# Altium project PCB_Project_work.PrjPcb
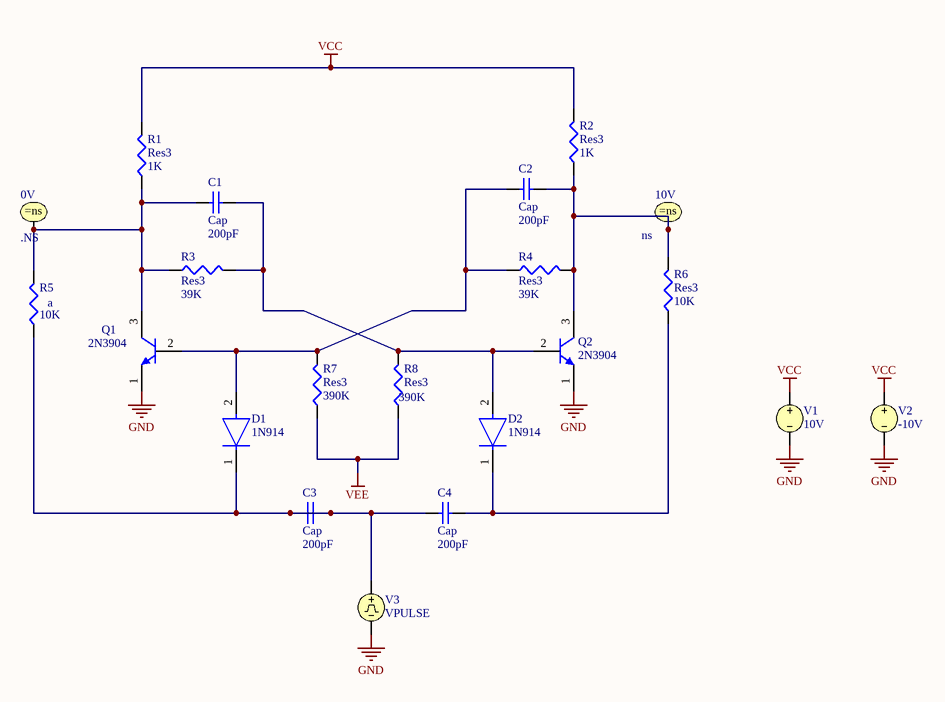
[diagram p0: classwork 2.0.SchDoc]
1 sheet, 21 parts. Net scope: global (net labels, ports and power ports of the same name join across sheets).
Board file: PCB4.PcbDoc

## Sheet classwork 2.0.SchDoc
size A4

### Parts
0V  .NS
10V  ns
C1  Cap  value 200pF  [RAD-0.3]
C2  Cap  value 200pF  [RAD-0.3]
C3  Cap  value 200pF  [RAD-0.3]
C4  Cap  value 200pF  [RAD-0.3]
D1  1N914  [FP-502-01-MFG]
D2  1N914  [FP-502-01-MFG]
Q1  2N3904  [ONSC-TO-92-3-29-11]
Q2  2N3904  [ONSC-TO-92-3-29-11]
R1  Res3  value 1K  [J1-0603]
R2  Res3  value 1K  [J1-0603]
R3  Res3  value 39K  [J1-0603]
R4  Res3  value 39K  [J1-0603]
R5  a  value 10K  [J1-0603]
R6  Res3  value 10K  [J1-0603]
R7  Res3  value 390K  [J1-0603]
R8  Res3  value 390K  [J1-0603]
V1  10V
V2  -10V
V3  VPULSE

### Nets
GND: Q1.1(E) Q2.1(E) V1.2 V2.2 V3.2
VCC: R1.2 R2.2 V1.1 V2.1
VEE: R7.1 R8.1
Net0V_1: 0V.1 C1.1 Q1.3(C) R1.1 R3.1 R5.2
Net10V_1: 10V.1 C2.2 Q2.3(C) R2.1 R4.2 R6.2
NetC1_2: C1.2 D2.2(A) Q2.2(B) R3.2 R8.2
NetC2_1: C2.1 D1.2(A) Q1.2(B) R4.1 R7.2
NetC3_1: C3.1 C3.2 C4.1 D1.1(C) R5.1 V3.1
NetC4_2: C4.2 D2.1(C) R6.1

### Library data of the parts
0V 10V = .NS: Node Set; Published: 8-Jun-2000; LatestRevisionDate: 17-Jul-2002; LatestRevisionNote: Re-released for DXP Platform.; PackageReference: Not Applicable; Publisher: Altium Limited
C1-C4 = Cap: Capacitor; Published: 8-Jun-2000; LatestRevisionDate: 17-Jul-2002; LatestRevisionNote: Re-released for DXP Platform.; PackageReference: RAD-0.3; Publisher: Altium Limited; PackageDescription: Radial Cap, Thru-Hole; 2 Leads; 0.3 in Pin Spacing
D1 D2 = CMP-07163-000008-1: DIODE GEN PURP 75V 200MA SOD523F; Manufacturer Part Number: 1N914BWT; Manufacturer: ON Semiconductor; Forward Current: 300mA; Capacitance: 4pF; Max Junction Temp: +150°C; Reverse Voltage: 100V; Value: 4pF; Peak Reverse Current: 5uA; ComponentLink2Description: Datasheet; Package: 502-01; Digikey Description: DIODE GEN PURP 75V 200MA SOD523F; Temperature Range High: +150°C; Temperature: -55°C to +150°C; Footprint Url: https://www.onsemi.com/pub/Collateral/502-01.PDF; Device Class L2: Diodes; Lead Free: Yes; Automotive: No; Category: Diode; Octopart: https://octopart.com/1n914bwt-on+semiconductor-84323166; Device Class L1: Discrete Semiconductors; Ipc Land Pattern Name: SODFL16080X60; Device Class L3: Rectifier Diodes; Height: 0.7mm; Max Repetitive Reverse Voltage: 75V; Mouser Description: Diodes - General Purpose, Power, Switching SINGLE JUNC. 100V 4.0NS COMP; Temperature Range Low: -55°C; ComponentLink2URL: https://www.onsemi.com/pub/Collateral/1N914BWT-D.pdf; RoHS: TRUE
Q1 Q2 = CMP-2000-05562-1: General Purpose Transistor, NPN Silicon, 200 mA, 60 V, -55 to 150 degC, 3-Pin TO-92, RoHS, Bulk; Manufacturer: ONSemiconductor; Emitter- Base Voltage VEBO: 6V; Maximum Power Dissipation: 625mW; Maximum DC Collector Current: 0.2A; Collector- Emitter Voltage VCEO Max: 40V; Collector- Base Voltage VCBO: 60V; DC Collector/Base Gain hfe Min: 60; Configuration: Single; Collector-Emitter Saturation Voltage: 0.3V; Gain Bandwidth Product fT: 270MHz; Mounting Style: ThroughHole; Package / Case: TO-92-3(TO-226); Mounting Technology: ThroughHole; Minimum Operating Temperature: -65C; Datasheet Version: Rev. 8, 08/2012; Product Category: BipolarTransistors-BJT; Factory Pack Quantity: 5000; Transistor Polarity: NPN; Package Description: 3-Pin Transistor Outline, Body 4.825 x 3.685 mm, Pitch 1.27 mm; RoHS: Details; Datasheet URL: https://datasheet.ciiva.com/4725/2n3903-d-285841-4725808.pdf; Packaging: Bulk; Maximum Operating Temperature: +150C; Package Reference: TO-92-3-29-11; Brand: ONSemiconductor; Manufacturer URL: http://www.onsemi.com/
R1-R8 = Res3: Resistor; Published: 8-Jun-2000; LatestRevisionDate: 29-May-2009; LatestRevisionNote: IPC-7351 Footprint Added.; PackageReference: J1-0603; Publisher: Altium Limited; PackageDescription: Chip Resistor
V1 V2 = VSRC: Voltage Source; Note: PCB Footprint - Not required; Published: 8-Jun-2000; LatestRevisionDate: 17-Jul-2002; LatestRevisionNote: Re-released for DXP Platform.; PackageReference: Not Applicable; Publisher: Altium Limited
V3 = VPULSE: Pulse Voltage Source; Note: PCB Footprint - Not required; Published: 8-Jun-2000; LatestRevisionDate: 15-Nov-2004; LatestRevisionNote: Corrected Netlist.; PackageReference: Not Applicable; Publisher: Altium Limited